# Altium schematic sheet TP4056_2025-01-24.schdoc
size 224 x 99 mm
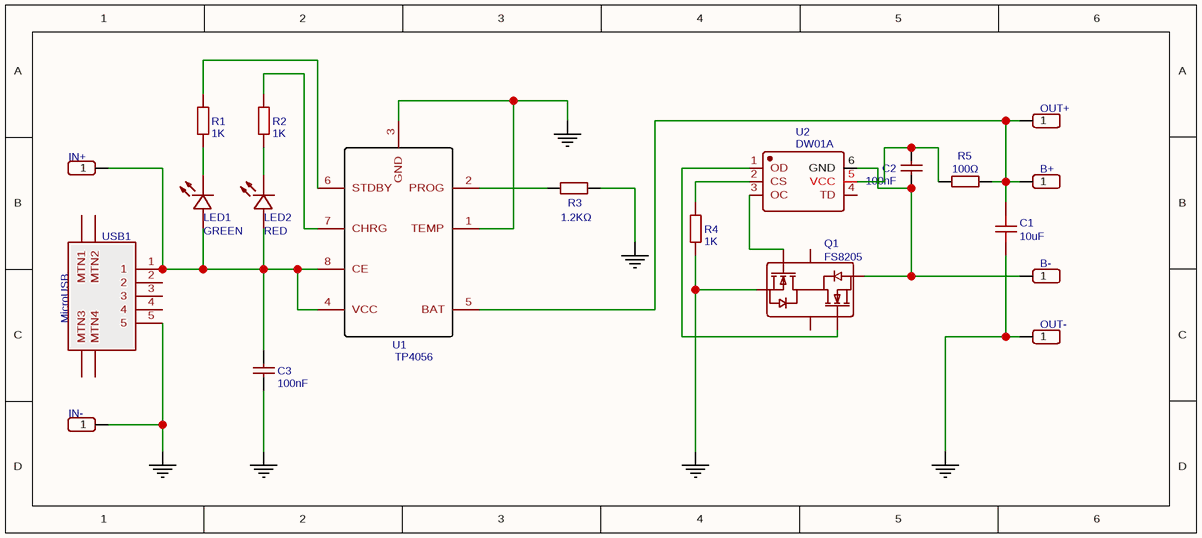
[diagram p0: TP4056_2025-01-24.schdoc]

## Parts
B+  Header-Male-2.54_1x1  [HDR-1X1/2.54]  (value not drawn)
B-  Header-Male-2.54_1x1  [HDR-1X1/2.54]  (value not drawn)
C1  10uF  [0603]
C2  100nF  [0603]
C3  100nF  [0603]
IN+  Header-Male-2.54_1x1  [HDR-1X1/2.54]  (value not drawn)
IN-  Header-Male-2.54_1x1  [HDR-1X1/2.54]  (value not drawn)
LED1  GREEN  [LED-0603]
LED2  RED  [LED-0603]
OUT+  Header-Male-2.54_1x1  [HDR-1X1/2.54]  (value not drawn)
OUT-  Header-Male-2.54_1x1  [HDR-1X1/2.54]  (value not drawn)
Q1  FS8205  [SOT-23-6]
R1  1K  [0603]
R2  1K  [0603]
R3  1.2KΩ  [0603]
R4  1K  [0603]
R5  100Ω  [0603]
U1  TP4056  [SOP-8_EP_150MIL]
U2  DW01A  [SOT-23-6L]
USB1  MicroUSB  [MICRO-USB-1]

## Nets
GND: C1.1 C3.1 IN-.1 OUT-.1 Q1.1(S1) R3.2 R4.1 U1.1(TEMP) U1.3(GND) USB1.5
NetB+_1: B+.1 C1.2 OUT+.1 R5.2 U1.5(BAT)
NetB-_1: B-.1 C2.2 Q1.3(S2) U2.6(GND)
NetC2_1: C2.1 R5.1 U2.5(VCC)
NetC3_2: C3.2 IN+.1 LED1.1(A) LED2.1(A) U1.4(VCC) U1.8(CE) USB1.1
NetLED1_2: LED1.2(K) R1.1
NetLED2_2: LED2.2(K) R2.2
NetQ1_4: Q1.4(G2) U2.1(OD)
NetQ1_6: Q1.6(G1) U2.3(OC)
NetR1_2: R1.2 U1.6(STDBY)
NetR2_1: R2.1 U1.7(CHRG)
NetR3_1: R3.1 U1.2(PROG)
NetR4_2: R4.2 U2.2(CS)

Not connected (* = marked no-connect by the designer): Q1 2(D12) 5(D12); U2 4(TD); USB1 0(MTN4) 2 3 4

## Library data of the parts
B+ B- IN+ IN- OUT+ OUT- = Header-Male-2.54_1x1: Manufacturer: ReliaPro; Supplier Part: C81276; Supplier: LCSC; Manufacturer Part: Header-Male-2.54_1x1; spicePre: P
C1 = 10uF: Manufacturer: SAMSUNG; Manufacturer Part: CL10A106MP8NNNC; nameAlias: Capacitance; Supplier: LCSC; Supplier Part: C85713; spicePre: C; spiceSymbolName: CL10A106MP8NNNC
C2 C3 = 100nF: Manufacturer: WTC; Manufacturer Part: 0603B104K250; nameAlias: Capacitance; Supplier: LCSC; Supplier Part: C83054; spicePre: C; spiceSymbolName: 0603B104K250
LED1 = GREEN: Manufacturer: LITEON; Manufacturer Part: LTST-C193TGKT-5A; Supplier: LCSC; Supplier Part: C12065; spicePre: L
LED2 = RED: Manufacturer: LITEON; Manufacturer Part: LTST-C191KRKT; Contributor: LCSC; Supplier: LCSC; Supplier Part: C125099; spicePre: L
Q1 = FS8205: Manufacturer: FORTUNE; Supplier: LCSC; Manufacturer Part: FS8205; LCSC Assembly: Yes; image: //image.lceda.cn/szlcsc/C32254.jpg; Supplier Part: C32254; spicePre: Q
R1 R2 R4 = 1K: Manufacturer: PANASONIC; Manufacturer Part: ERJ3GEYJ102V; nameAlias: Resistance (Ohms); Contributor: LCSC; Supplier: LCSC; Supplier Part: C180848; spicePre: R; spiceSymbolName: ERJ3GEYJ102V
R3 = 1.2KΩ: Manufacturer: YAGEO; Manufacturer Part: RC0603JR-071K2L; nameAlias: Value; Supplier: LCSC; Supplier Part: C114679; spicePre: R; spiceSymbolName: RC0603JR-071K2L
R5 = 100Ω: Manufacturer: UniOhm; Manufacturer Part: 0603WAJ0101T5E; nameAlias: Value; Supplier: LCSC; Supplier Part: C25201; spicePre: R; spiceSymbolName: 0603WAJ0101T5E
U1 = TP4056: Manufacturer: TOPPOWER; Contributor: Guest; Supplier: LCSC; Manufacturer Part: TP4056; LCSC Assembly: Yes; image: //image.lceda.cn/szlcsc/C16581.jpg; Supplier Part: C16581; spicePre: U
U2 = DW01A: Manufacturer: PUOLOP; Contributor: LCSC; Supplier: LCSC; Manufacturer Part: DW01A; Supplier Part: C351410; spicePre: U
USB1 = MicroUSB: Manufacturer: ValuePro; Manufacturer Part: micro USBFemale; Supplier: LCSC; image: //image.lceda.cn/szlcsc/C10418.jpg; Supplier Part: C10418; spicePre: U